# EAGLE schematic ENGI301_Maze_Project (EAGLE 9.0.0)
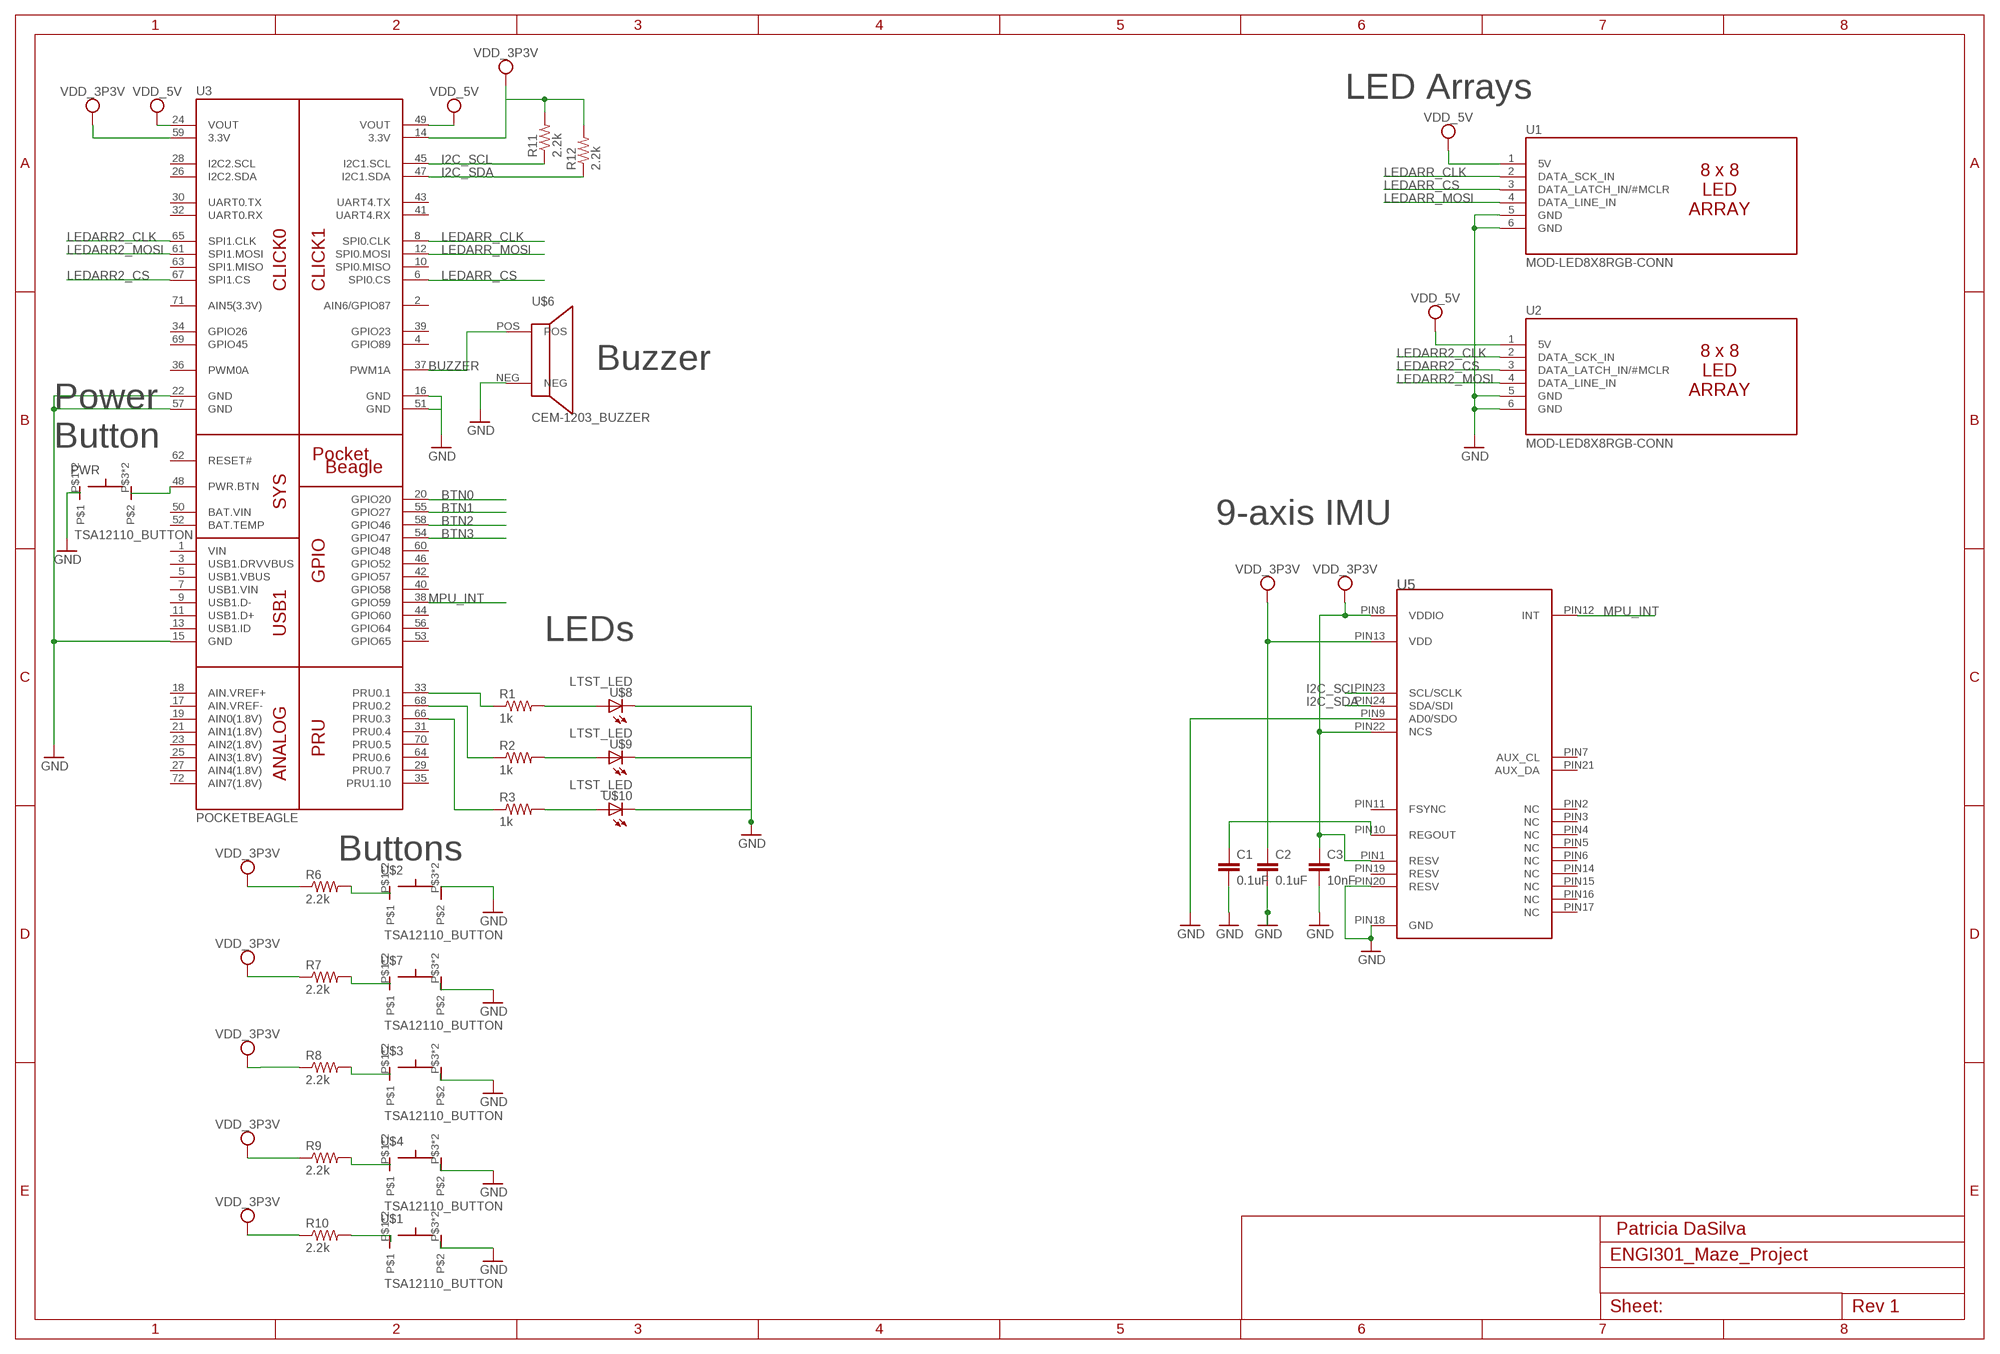
[diagram p0: schematic, sheet 1]

## Parts
C1  0.1uF  C_C0402  [C0402]
C2  0.1uF  C_C0402  [C0402]
C3  10nF  C_C0402  [C0402]
PWR  TSA12110_BUTTON  [4HOLE-THRU]
R1  1k  R_R0603  [R0603]
R2  1k  R_R0603  [R0603]
R3  1k  R_R0603  [R0603]
R6  2.2k  R_R0603  [R0603]
R7  2.2k  R_R0603  [R0603]
R8  2.2k  R_R0603  [R0603]
R9  2.2k  R_R0603  [R0603]
R10  2.2k  R_R0603  [R0603]
R11  2.2k  R_R0603  [R0603]
R12  2.2k  R_R0603  [R0603]
U1  MOD-LED8X8RGB-CONN  [FE06W]
U2  MOD-LED8X8RGB-CONN  [FE06W]
U3  POCKETBEAGLE  [POCKETBEAGLE]
U5  MPU9250  [QFN_3MMX3MM]
U$1  TSA12110_BUTTON  [4HOLE-THRU]
U$2  TSA12110_BUTTON  [4HOLE-THRU]
U$3  TSA12110_BUTTON  [4HOLE-THRU]
U$4  TSA12110_BUTTON  [4HOLE-THRU]
U$6  CEM-1203_BUZZER  [2HOLE-THRU]
U$7  TSA12110_BUTTON  [4HOLE-THRU]
U$8  LTST_LED  [SMD_0.8X0.8MM]
U$9  LTST_LED  [SMD_0.8X0.8MM]
U$10  LTST_LED  [SMD_0.8X0.8MM]

## Nets
BTN0: U3.20(GPIO20)
BTN1: U3.55(GPIO27)
BTN2: U3.58(GPIO46)
BTN3: U3.54(GPIO47)
BUZZER: U3.37(PWM1A) U$6.POS
GND: C1.2 C2.2 C3.2 PWR.P$1 PWR.P$2 U1.5(GND) U1.6(GND) U2.5(GND) U2.6(GND) U3.15(GND) U3.16(GND) U3.22(GND) U3.51(GND) U3.57(GND) U5.PIN9(AD0/SDO) U5.PIN18(GND) U5.PIN20(RESV) U$1.P$3 U$1.P$4 U$3.P$3 U$3.P$4 U$4.P$3 U$4.P$4 U$6.NEG U$7.P$3 U$7.P$4 U$8.C(CATHODE) U$9.C(CATHODE) U$10.C(CATHODE)
I2C_SCL: R11.1 U3.45(I2C1.SCL) U5.PIN23(SCL/SCLK)
I2C_SDA: R12.1 U3.47(I2C1.SDA) U5.PIN24(SDA/SDI)
LEDARR2_CLK: U2.2(DATA_SCK_IN) U3.65(SPI1.CLK)
LEDARR2_CS: U2.3(DATA_LATCH_IN/#MCLR) U3.67(SPI1.CS)
LEDARR2_MOSI: U2.4(DATA_LINE_IN) U3.61(SPI1.MOSI)
LEDARR_CLK: U1.2(DATA_SCK_IN) U3.8(SPI0.CLK)
LEDARR_CS: U1.3(DATA_LATCH_IN/#MCLR) U3.6(SPI0.CS)
LEDARR_MOSI: U1.4(DATA_LINE_IN) U3.12(SPI0.MOSI)
MPU_INT: U3.38(GPIO59) U5.PIN12(INT)
N$1: PWR.P$3 PWR.P$4 U3.48(PWR.BTN)
N$2: R1.1 U3.33(PRU0.1)
N$3: R2.1 U3.68(PRU0.2)
N$4: C1.1 U5.PIN10(REGOUT)
N$5: R3.1 U3.66(PRU0.3)
N$6: R6.2 U$2.P$1 U$2.P$2
N$7: R1.2 U$8.A(ANODE)
N$8: R7.2 U$7.P$1 U$7.P$2
N$9: R2.2 U$9.A(ANODE)
N$10: R8.2 U$3.P$1 U$3.P$2
N$11: R3.2 U$10.A(ANODE)
N$12: R9.2 U$4.P$1 U$4.P$2
N$13: R10.2 U$1.P$1 U$1.P$2
SYS_VDD1_3P3V: C2.1 C3.1 R6.1 R7.1 R8.1 R9.1 R10.1 R11.2 R12.2 U1.1(5V) U2.1(5V) U3.14(3.3V) U3.24(VOUT) U3.49(VOUT) U3.59(3.3V) U5.PIN1(RESV) U5.PIN8(VDDIO) U5.PIN13(VDD) U5.PIN22(NCS) ; supply symbol labelled VDD_3P3V, VDD_5V
Unconnected: U3.1(VIN) U3.2(AIN6/GPIO87) U3.3(USB1.DRVVBUS) U3.4(GPIO89) U3.5(USB1.VBUS) U3.7(USB1.VIN) U3.9(USB1.D-) U3.10(SPI0.MISO) U3.11(USB1.D+) U3.13(USB1.ID) U3.17(AIN.VREF-) U3.18(AIN.VREF+) U3.19(AIN0(1.8V)) U3.21(AIN1(1.8V)) U3.23(AIN2(1.8V)) U3.25(AIN3(1.8V)) U3.26(I2C2.SDA) U3.27(AIN4(1.8V)) U3.28(I2C2.SCL) U3.29(PRU0.7) U3.30(UART0.TX) U3.31(PRU0.4) U3.32(UART0.RX) U3.34(GPIO26) U3.35(PRU1.10) U3.36(PWM0A) U3.39(GPIO23) U3.40(GPIO58) U3.41(UART4.RX) U3.42(GPIO57) U3.43(UART4.TX) U3.44(GPIO60) U3.46(GPIO52) U3.50(BAT.VIN) U3.52(BAT.TEMP) U3.53(GPIO65) U3.56(GPIO64) U3.60(GPIO48) U3.62(RESET#) U3.63(SPI1.MISO) U3.64(PRU0.6) U3.69(GPIO45) U3.70(PRU0.5) U3.71(AIN5(3.3V)) U3.72(AIN7(1.8V)) U5.PIN2(NC) U5.PIN3(NC) U5.PIN4(NC) U5.PIN5(NC) U5.PIN6(NC) U5.PIN7(AUX_CL) U5.PIN11(FSYNC) U5.PIN14(NC) U5.PIN15(NC) U5.PIN16(NC) U5.PIN17(NC) U5.PIN19(RESV) U5.PIN21(AUX_DA) U$2.P$3 U$2.P$4

## Notes on the sheet
- LED Arrays
- Buzzer
- Power 
  Button
- 9-axis IMU
- LEDs
- Buttons
- Patricia DaSilva

## Library data of the parts
C1-C3 = IMU:C_: Capacitor SMD. Sizes: 0402, 0603 & 0805
PWR U$1-U$4 U$7 = Project#2:TSA12110_BUTTON: A 4-pin button
R1-R3 R6-R12 = Project#2:R_: RESISTOR, American symbol
U1 U2 = Project#2:MOD-LED8X8RGB-CONN
U3 = Project#2:POCKETBEAGLE
U5 = IMU:MPU9250: MPU9250 is a motion tracking device consisting of a QFN (3mm x 3mm) package
U$6 = Project#2:CEM-1203_BUZZER: A buzzer
U$8-U$10 = Project#2:LTST_LED: An LED ( 0.8x0.8MM SMD )